# EAGLE design schema_v1_1 (EAGLE 5.12)
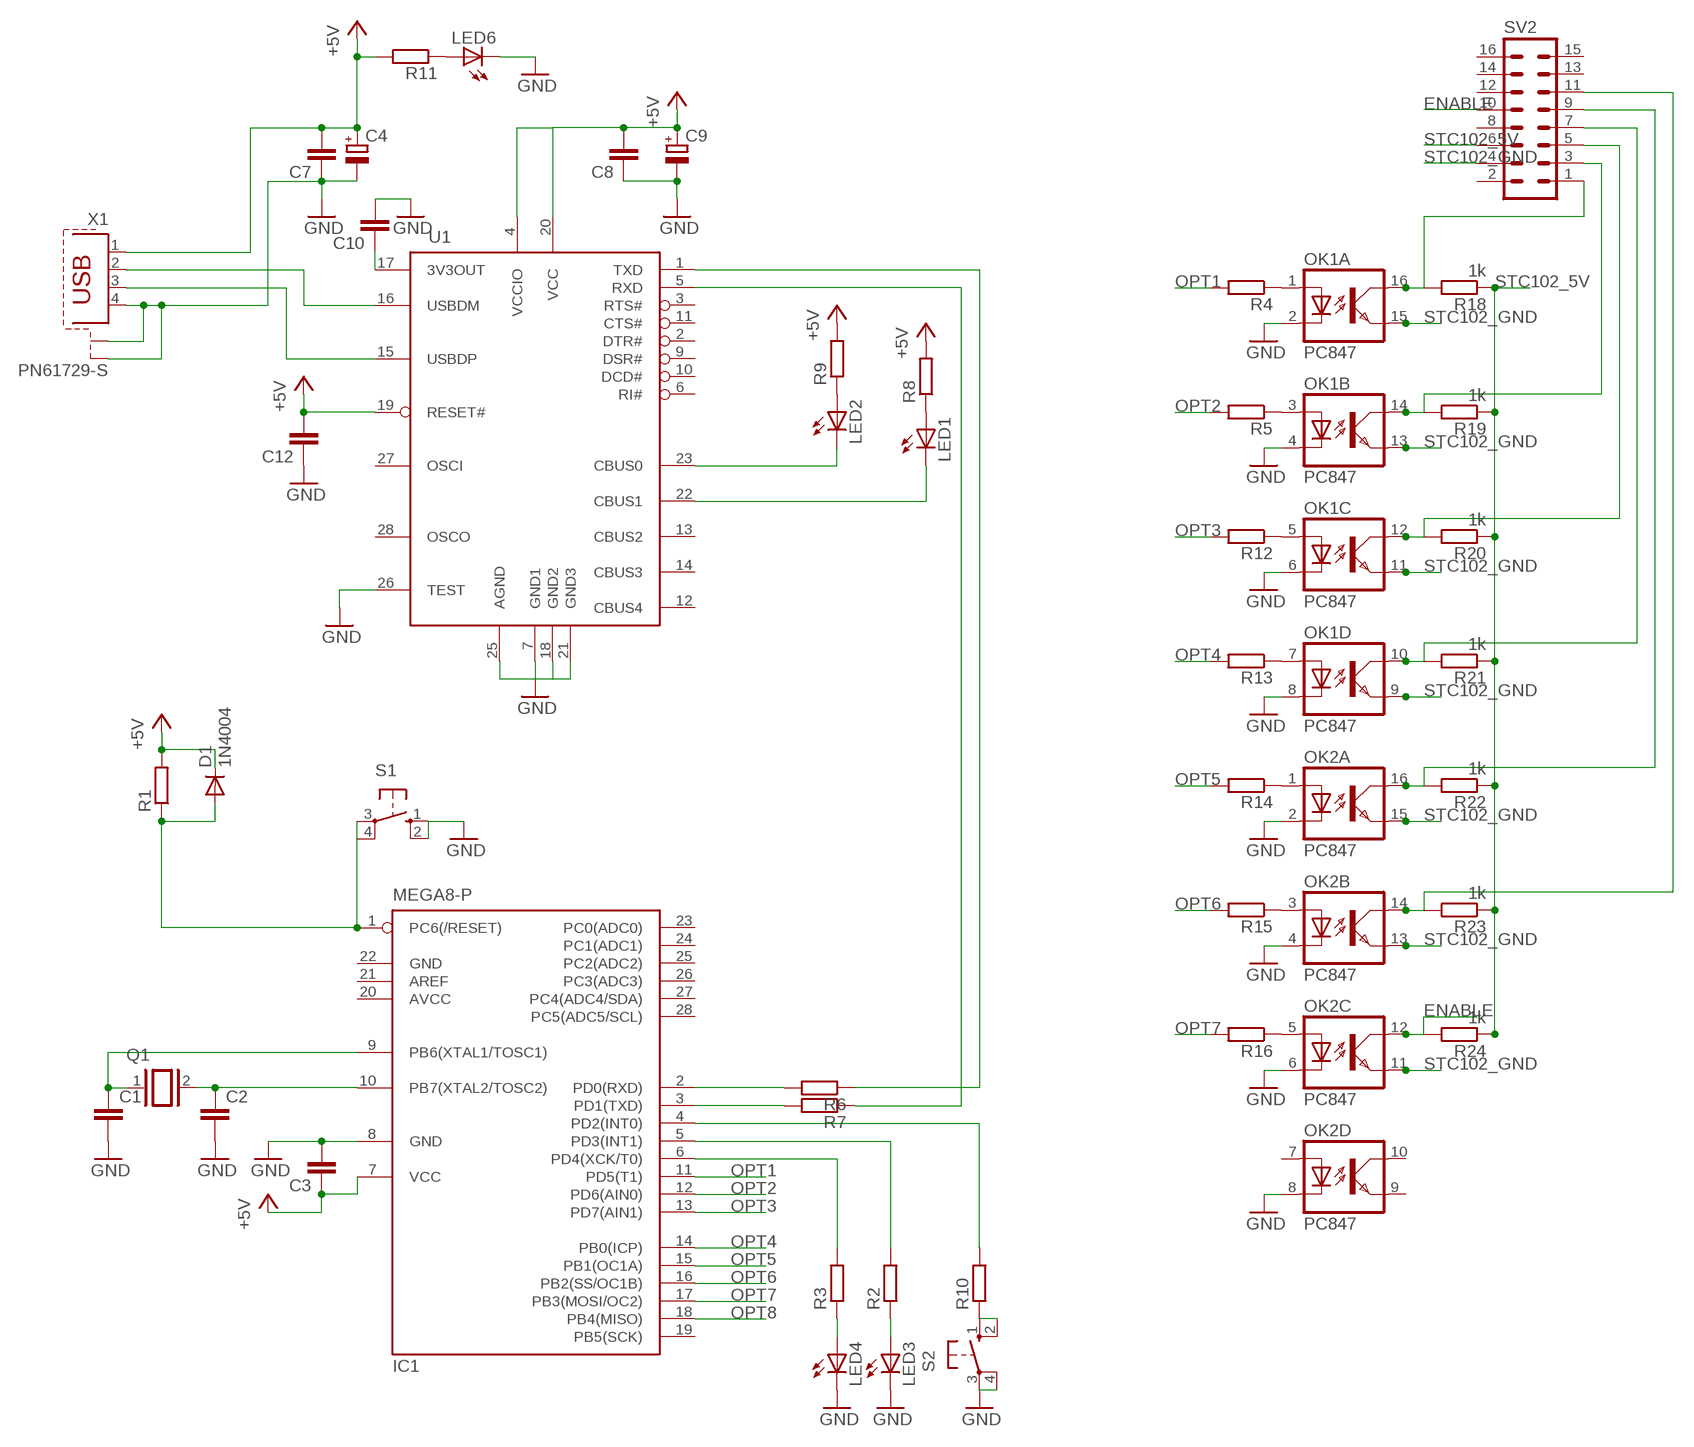
[diagram p0: schematic, sheet 1]

## Parts
C1  C-EUC0805  [C0805]
C2  C-EUC0805  [C0805]
C3  C-EUC0805  [C0805]
C4  CPOL-EUE2.5-5  [E2,5-5]
C7  C-EU025-025X050  [C025-025X050]
C8  C-EU025-025X050  [C025-025X050]
C9  CPOL-EUE2.5-5  [E2,5-5]
C10  C-EU025-025X050  [C025-025X050]
C12  C-EU025-025X050  [C025-025X050]
D1  1N4004  [DO41-10]
IC1  MEGA8-P  [DIL28-3]
LED1  LED3MM  [LED3MM]
LED2  LED3MM  [LED3MM]
LED3  LED3MM  [LED3MM]
LED4  LED3MM  [LED3MM]
LED6  LED3MM  [LED3MM]
OK1  PC847  [DIL16]
OK2  PC847  [DIL16]
Q1  XTAL  [Q]
R1  R-EU_0207/10  [0207/10]
R2  R-EU_0207/10  [0207/10]
R3  R-EU_0207/10  [0207/10]
R4  R-EU_0207/10  [0207/10]
R5  R-EU_0207/10  [0207/10]
R6  R-EU_M1206  [M1206]
R7  R-EU_M1206  [M1206]
R8  R-EU_M1206  [M1206]
R9  R-EU_M1206  [M1206]
R10  R-EU_0207/10  [0207/10]
R11  R-EU_M1206  [M1206]
R12  R-EU_0207/10  [0207/10]
R13  R-EU_0207/10  [0207/10]
R14  R-EU_0207/10  [0207/10]
R15  R-EU_0207/10  [0207/10]
R16  R-EU_0207/10  [0207/10]
R18  1k  R-EU_0207/10  [0207/10]
R19  1k  R-EU_0207/10  [0207/10]
R20  1k  R-EU_0207/10  [0207/10]
R21  1k  R-EU_0207/10  [0207/10]
R22  1k  R-EU_0207/10  [0207/10]
R23  1k  R-EU_0207/10  [0207/10]
R24  1k  R-EU_0207/10  [0207/10]
S1  10-XX  [B3F-10XX]
S2  10-XX  [B3F-10XX]
SV2  MA08-2  [MA08-2]
U1  FT232RL  [SSOP28DB]
X1  PN61729-S  [PN61729-S]

## Nets
+5V: C3.1 C4.+ C7.2 C8.2 C9.+ C12.2 D1.C IC1.7(VCC) R1.2 R8.2 R9.2 R11.2 U1.4(VCCIO) U1.19(RESET#) U1.20(VCC) X1.1
ENABLE: OK2.12(C:COL) R24.2 SV2.10
GND: C1.2 C2.2 C3.2 C4.- C7.1 C8.1 C9.- C10.2 C12.1 IC1.8(GND) LED3.K(C) LED4.K(C) LED6.K(C) OK1.2(A:C) OK1.4(B:C) OK1.6(C:C) OK1.8(D:C) OK2.2(A:C) OK2.4(B:C) OK2.6(C:C) OK2.8(D:C) S1.1(S) S1.2(S1) S2.3(P) S2.4(P1) U1.7(GND1) U1.18(GND2) U1.21(GND3) U1.25(AGND) U1.26(TEST) X1.4 X1.S1 X1.S2
N$1: C2.1 IC1.10(PB7(XTAL2/TOSC2)) Q1.2
N$2: C1.1 IC1.9(PB6(XTAL1/TOSC1)) Q1.1
N$3: D1.A IC1.1(PC6(/RESET)) R1.1 S1.3(P) S1.4(P1)
N$4: IC1.6(PD4(XCK/T0)) R3.2
N$5: IC1.4(PD2(INT0)) R10.2
N$6: LED3.A R2.1
N$7: LED4.A R3.1
N$8: R10.1 S2.1(S) S2.2(S1)
N$9: OK1.16(A:COL) R18.2 SV2.1
N$10: IC1.5(PD3(INT1)) R2.2
N$11: OK1.14(B:COL) R19.2 SV2.3
N$12: OK1.12(C:COL) R20.2 SV2.5
N$13: OK1.10(D:COL) R21.2 SV2.7
N$14: OK2.16(A:COL) R22.2 SV2.9
N$15: OK2.14(B:COL) R23.2 SV2.11
N$16: LED2.K(C) U1.23(CBUS0)
N$17: LED6.A R11.1
N$18: U1.16(USBDM) X1.2
N$19: U1.15(USBDP) X1.3
N$20: C10.1 U1.17(3V3OUT)
N$21: LED1.A R8.1
N$22: LED2.A R9.1
N$24: LED1.K(C) U1.22(CBUS1)
N$25: R6.1 U1.1(TXD)
N$26: IC1.2(PD0(RXD)) R6.2
N$27: IC1.3(PD1(TXD)) R7.2
N$28: R7.1 U1.5(RXD)
N$29: OK1.1(A:A) R4.1
N$30: OK1.3(B:A) R5.1
N$31: OK1.5(C:A) R12.1
N$32: OK1.7(D:A) R13.1
N$33: OK2.1(A:A) R14.1
N$34: OK2.3(B:A) R15.1
N$35: OK2.5(C:A) R16.1
OPT1: IC1.11(PD5(T1)) R4.2
OPT2: IC1.12(PD6(AIN0)) R5.2
OPT3: IC1.13(PD7(AIN1)) R12.2
OPT4: IC1.14(PB0(ICP)) R13.2
OPT5: IC1.15(PB1(OC1A)) R14.2
OPT6: IC1.16(PB2(SS/OC1B)) R15.2
OPT7: IC1.17(PB3(MOSI/OC2)) R16.2
OPT8: IC1.18(PB4(MISO))
STC102_5V: R18.1 R19.1 R20.1 R21.1 R22.1 R23.1 R24.1 SV2.6
STC102_GND: OK1.9(D:EMIT) OK1.11(C:EMIT) OK1.13(B:EMIT) OK1.15(A:EMIT) OK2.11(C:EMIT) OK2.13(B:EMIT) OK2.15(A:EMIT) SV2.4
Unconnected: IC1.19(PB5(SCK)) IC1.21(AREF) IC1.23(PC0(ADC0)) IC1.24(PC1(ADC1)) IC1.25(PC2(ADC2)) IC1.26(PC3(ADC3)) IC1.27(PC4(ADC4/SDA)) IC1.28(PC5(ADC5/SCL)) OK2.7(D:A) OK2.9(D:EMIT) OK2.10(D:COL) SV2.2 SV2.8 SV2.12 SV2.13 SV2.14 SV2.15 SV2.16 U1.2(DTR#) U1.3(RTS#) U1.6(RI#) U1.9(DSR#) U1.10(DCD#) U1.11(CTS#) U1.12(CBUS4) U1.13(CBUS2) U1.14(CBUS3) U1.27(OSCI) U1.28(OSCO)

## Power pins joined to a net without a drawn wire
AVCC: IC1.20(AVCC)
GND: IC1.22(GND)

## Library data of the parts
C1-C3 C7 C8 C10 C12 = rcl:C-EU: CAPACITOR, European symbol
C4 C9 = rcl:CPOL-EU: POLARIZED CAPACITOR, European symbol
D1 = diode:1N4004: DIODE general purpose rectifier, 1 A
IC1 = atmel:MEGA8-P: MICROCONTROLLER 8 Kbytes FLASH, 1 kbytes SRAM, 512 bytes EEPROM, USART, 4-channel 10 bit ADC, 2-channel 8 bit ADC Pin compatible with Atmega48, ATMega88, ATMega168 Source: avr.lbr; OC_FARNELL: unknown; OC_NEWARK: unknown
LED1-LED4 LED6 = led:LED: LED OSRAM: - CHIPLED LG R971, LG N971, LY N971, LG Q971, LY Q971, LO R971, LY R971 LH N974, LH R974 LS Q976, LO Q976, LY Q976 LO Q996 - Hyper CHIPLED LW Q18S LB Q993, LB Q99A, LB R99A - SideLED LS A670, LO A670, LY A670, LG A670, LP A670 LB A673, LV A673, LT A673, LW A673 LH A674 LY A675 LS A676, LA A676, LO A676, LY A676, LW A676 LS A679, LY A679, LG A679 - Hyper Micro SIDELED® LS Y876, LA Y876, LO Y876, LY Y876 LT Y87S - SmartLED LW L88C, LW L88S LB L89C, LB L89S, LG L890 LS L89K, LO L89K, LY L89K LS L896, LA L896, LO L896, LY L896 - TOPLED LS T670, LO T670, LY T670, LG T670, LP T670 LSG T670, LSP T670, LSY T670, LOP T670, LYG T670 LG T671, LOG T671, LSG T671 LB T673, LV T673, LT T673, LW T673 LH T674 LS T676, LA T676, LO T676, LY T676, LB T676, LH T676, LSB T676, LW T676 LB T67C, LV T67C, LT T67C, LS T67K, LO T67K, LY T67K, LW E67C LS E67B, LA E67B, LO E67B, LY E67B, LB E67C, LV E67C, LT E67C LW T67C LS T679, LY T679, LG T679 LS T770, LO T770, LY T770, LG T770, LP T770 LB T773, LV T773, LT T773, LW T773 LH T774 LS E675, LA E675, LY E675, LS T675 LS T776, LA T776, LO T776, LY T776, LB T776 LHGB T686 LT T68C, LB T68C - Hyper Mini TOPLED® LB M676 - Mini TOPLED Santana® LG M470 LS M47K, LO M47K, LY M47K Source: http://www.osram.convergy.de LUXEON: - LUMILED® LXK2-PW12-R00, LXK2-PW12-S00, LXK2-PW14-U00, LXK2-PW14-V00 LXK2-PM12-R00, LXK2-PM12-S00, LXK2-PM14-U00 LXK2-PE12-Q00, LXK2-PE12-R00, LXK2-PE12-S00, LXK2-PE14-T00, LXK2-PE14-U00 LXK2-PB12-K00, LXK2-PB12-L00, LXK2-PB12-M00, LXK2-PB14-N00, LXK2-PB14-P00, LXK2-PB14-Q00 LXK2-PR12-L00, LXK2-PR12-M00, LXK2-PR14-Q00, LXK2-PR14-R00 LXK2-PD12-Q00, LXK2-PD12-R00, LXK2-PD12-S00 LXK2-PH12-R00, LXK2-PH12-S00 LXK2-PL12-P00, LXK2-PL12-Q00, LXK2-PL12-R00 Source: www.luxeon.com KINGBRIGHT: KA-3528ASYC Source: www.kingbright.com
OK1 OK2 = optocoupler:PC847: SHARP OPTO COUPLER; OC_FARNELL: 9707735; OC_NEWARK: unknown
Q1 = special:XTAL: CRYSTAL
R1-R16 R18-R24 = rcl:R-EU_: RESISTOR, European symbol
S1 S2 = switch-omron:10-XX: OMRON SWITCH; MPN: B3F-1000; OC_FARNELL: 176432; OC_NEWARK: 36M3542
SV2 = con-lstb:MA08-2: PIN HEADER; OC_FARNELL: unknown; OC_NEWARK: unknown
U1 = ftdichip-5:FT232RL: USB UART 4th Generation USB UART (USB <-> Serial) Controller
X1 = con-berg:PN61729-S: BERG USB connector; OC_FARNELL: unknown; OC_NEWARK: unknown

## Board
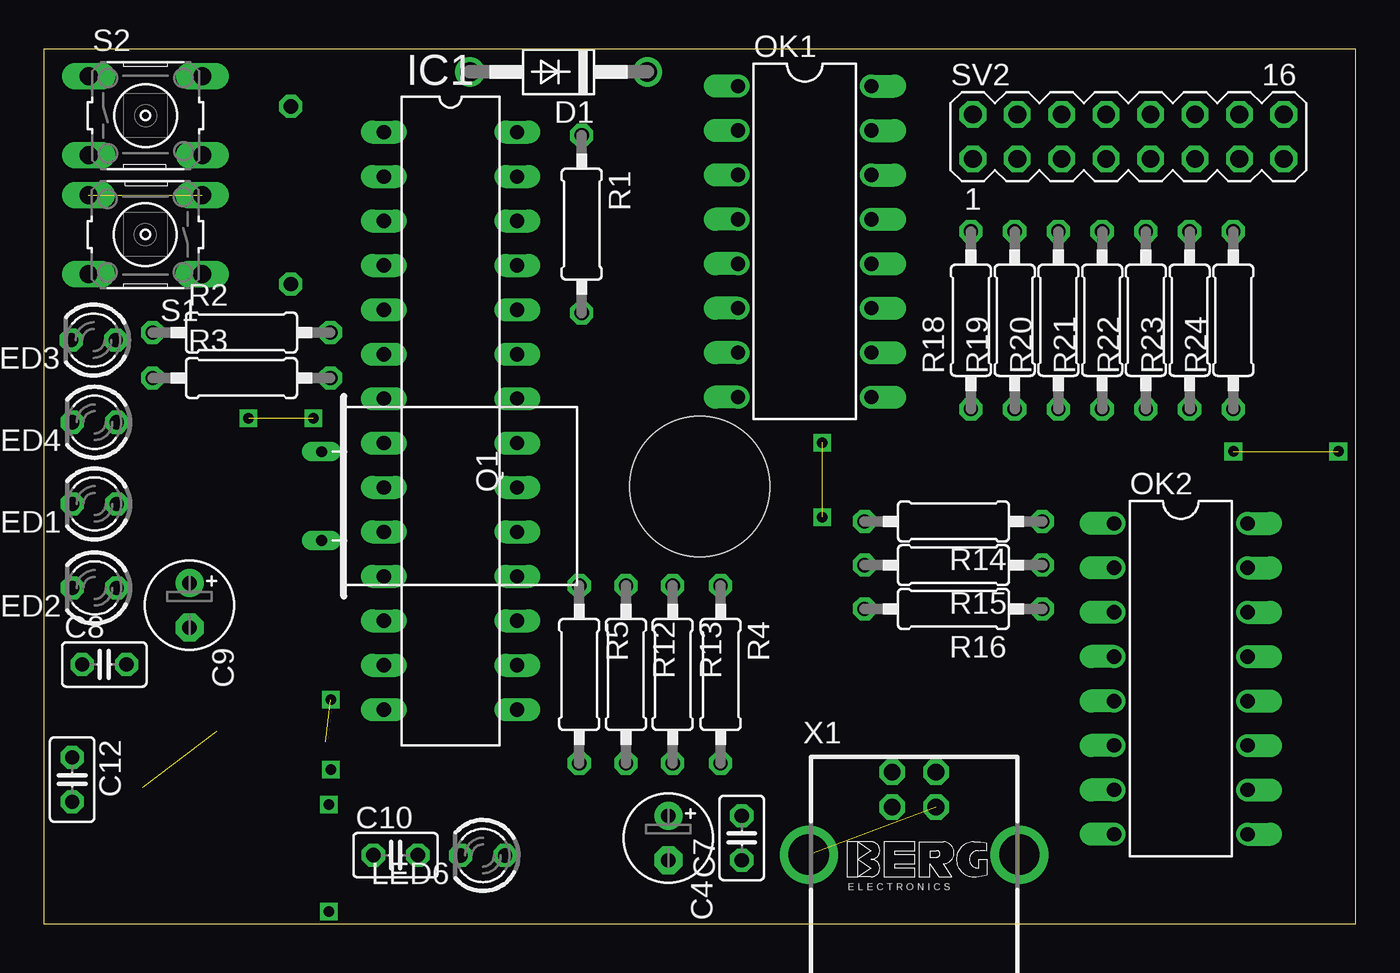
[diagram p1: board, top side]
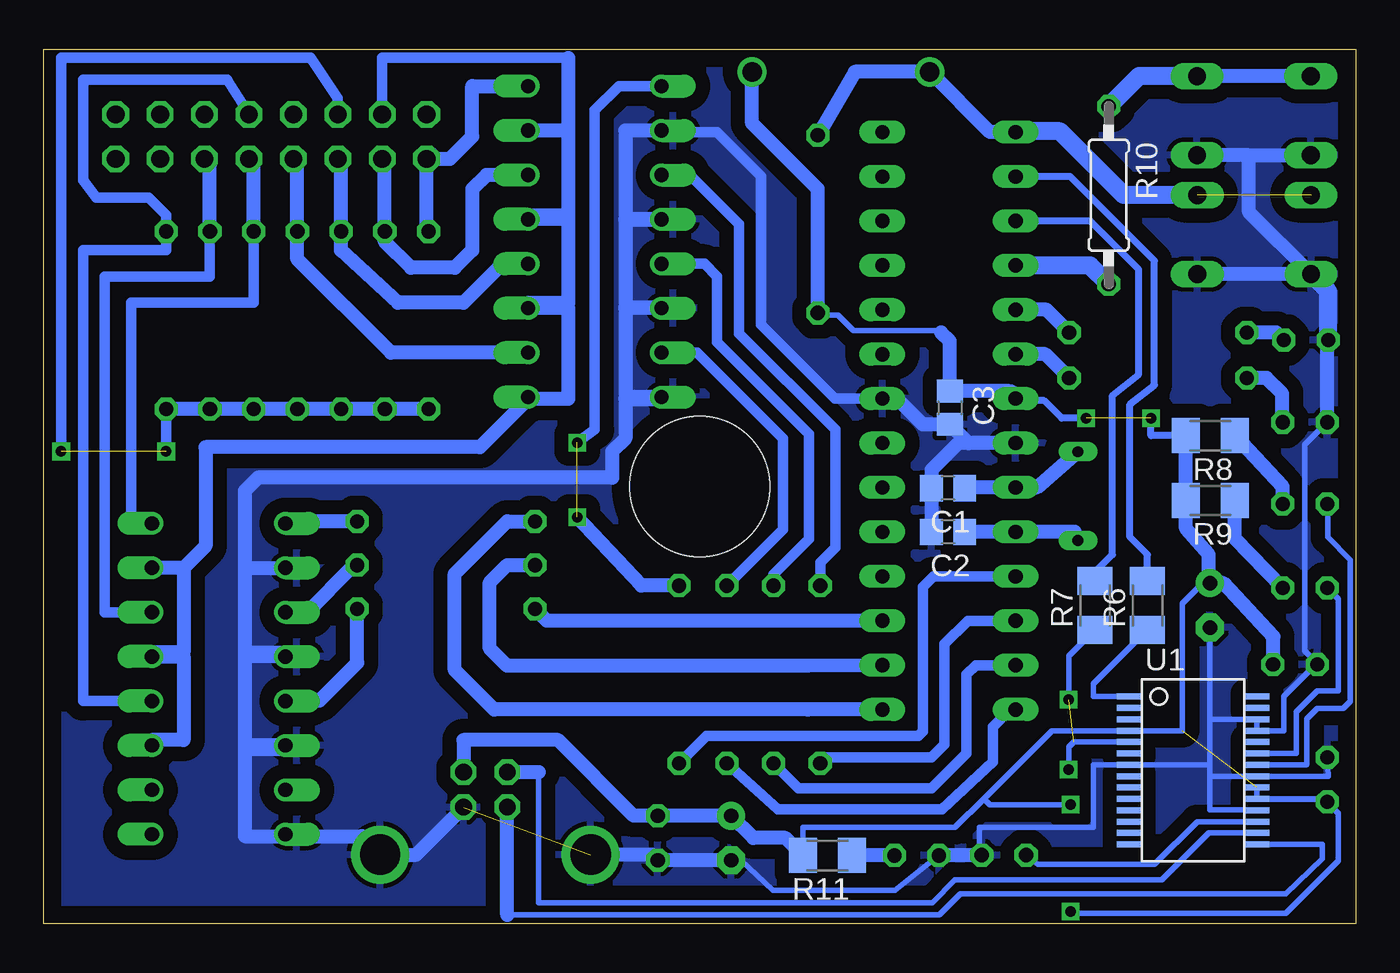
[diagram p2: board, bottom side, seen from below]

Size 75 x 50 mm. Coordinates in mm from the lower left corner, seen from the top.
Outline: 0,0 75,0 75,50 0,50 0,0
Copper layers (1*16): Top 0.035mm / dielectric 1.5mm / Bottom 0.035mm
Design rules "default": minimum track width 10mil, minimum drill 24mil, track to track 8mil, track to pad 8mil, pad to pad 8mil, via to via 8mil, smd to smd 8mil, copper to edge 40mil, drill to drill 8mil, minimum pad ring 10mil, minimum via ring 8mil, stop-mask expansion 4mil, vias tented up to drill 0mil, thermal gap 10mil
Holes 8 mm at 37.5,25

### Footprints (pad centres in the part's own frame; a part is rotated, then mirrored left to right if it is on the bottom)
C0805 = smd 1.3 x 1.5: 1 -0.95,0; 2 0.95,0
E2,5-5 = drill 0.813 pad 1.6 round: + -1.27,0 | drill 0.813 pad 1.6 octagon: - 1.27,0
C025-025X050 = drill 0.813 octagon: 1 -1.27,0; 2 1.27,0
DO41-10 = drill 1.118 round: A 5.08,0; C -5.08,0
DIL28-3 = drill 0.813 long: 1 -16.51,-3.81; 2 -13.97,-3.81; 3 -11.43,-3.81; 4 -8.89,-3.81; 5 -6.35,-3.81; 6 -3.81,-3.81; 7 -1.27,-3.81; 8 1.27,-3.81; 9 3.81,-3.81; 10 6.35,-3.81; 11 8.89,-3.81; 12 11.43,-3.81; 13 13.97,-3.81; 14 16.51,-3.81; 15 16.51,3.81; 16 13.97,3.81; 17 11.43,3.81; 18 8.89,3.81; 19 6.35,3.81; 20 3.81,3.81; 21 1.27,3.81; 22 -1.27,3.81; 23 -3.81,3.81; 24 -6.35,3.81; 25 -8.89,3.81; 26 -11.43,3.81; 27 -13.97,3.81; 28 -16.51,3.81
LED3MM = drill 0.813 octagon: A -1.27,0; K 1.27,0
DIL16 = drill 0.813 offset: 1 -8.89,-3.81; 2 -6.35,-3.81; 3 -3.81,-3.81; 4 -1.27,-3.81; 5 1.27,-3.81; 6 3.81,-3.81; 7 6.35,-3.81; 8 8.89,-3.81; 9 8.89,3.81; 10 6.35,3.81; 11 3.81,3.81; 12 1.27,3.81; 13 -1.27,3.81; 14 -3.81,3.81; 15 -6.35,3.81; 16 -8.89,3.81
Q = drill 0.61 long: 1 -2.54,-7.62; 2 2.54,-7.62
0207/10 = drill 0.813 octagon: 1 -5.08,0; 2 5.08,0
M1206 = smd 1.6 x 2: 1 -1.4,0; 2 1.4,0
B3F-10XX = drill 1.016 long: 1 -3.251,2.261; 2 3.251,2.261; 3 -3.251,-2.261; 4 3.251,-2.261
MA08-2 = drill 1.016 octagon: 1 -8.89,-1.27; 2 -8.89,1.27; 3 -6.35,-1.27; 4 -6.35,1.27; 5 -3.81,-1.27; 6 -3.81,1.27; 7 -1.27,-1.27; 8 -1.27,1.27; 9 1.27,-1.27; 10 1.27,1.27; 11 3.81,-1.27; 12 3.81,1.27; 13 6.35,-1.27; 14 6.35,1.27; 15 8.89,-1.27; 16 8.89,1.27
SSOP28DB = smd 0.348 x 1.397: 1 -4.225,-3.656; 2 -3.575,-3.656; 3 -2.925,-3.656; 4 -2.275,-3.656; 5 -1.625,-3.656; 6 -0.975,-3.656; 7 -0.325,-3.656; 8 0.325,-3.656; 9 0.975,-3.656; 10 1.625,-3.656; 11 2.275,-3.656; 12 2.925,-3.656; 13 3.575,-3.656; 14 4.225,-3.656; 15 4.225,3.656; 16 3.575,3.656; 17 2.925,3.656; 18 2.275,3.656; 19 1.625,3.656; 20 0.975,3.656; 21 0.325,3.656; 22 -0.325,3.656; 23 -0.975,3.656; 24 -1.625,3.656; 25 -2.275,3.656; 26 -2.925,3.656; 27 -3.575,3.656; 28 -4.225,3.656
PN61729-S = drill 0.95 octagon: 1 1.25,4.71; 2 -1.25,4.71; 3 -1.25,2.71; 4 1.25,2.71 | drill 2.3 pad 2.9 round: S1 -6.02,0; S2 6.02,0

### Placement (x,y rotation side)
C1  23.3,24.9 180 bottom
C2  23.3,22.4 180 bottom
C3  23.2,29.5 270 bottom
C4  35.7,4.9 270 top
C7  39.9,4.9 90 top
C8  3.46,14.82 0 top
C9  8.33,18.2 270 top
C10  20.11,3.92 0 top
C12  1.62,8.24 270 top
D1  29.43,48.7 180 top
IC1  23.25,28.75 270 top
LED1  2.9,24 180 top
LED2  2.9,19.2 180 top
LED3  2.84,33.37 180 top
LED4  2.9,28.67 180 top
LED6  25.1,3.9 180 top
OK1  43.5,39 270 top
OK2  65,14 270 top
Q1  23.5,24.45 270 top
R1  30.75,40 270 top
R2  11.3,33.8 0 top
R3  11.3,31.2 0 top
R4  38.69,14.25 270 top
R5  30.61,14.25 270 top
R6  11.9,18.2 90 bottom
R7  14.9,18.2 90 bottom
R8  8.3,27.9 180 bottom
R9  8.3,24.2 180 bottom
R10  14.12,41.65 270 bottom
R11  30.2,3.9 180 bottom
R12  33.28,14.25 270 top
R13  35.95,14.25 270 top
R14  52,23 180 top
R15  52,20.5 180 top
R16  52,18 180 top
R18  53,34.5 90 top
R19  55.5,34.5 90 top
R20  58,34.5 90 top
R21  60.5,34.5 90 top
R22  63,34.5 90 top
R23  65.5,34.5 90 top
R24  68,34.5 90 top
S1  5.8,39.4 180 top
S2  5.82,46.2 0 top
SV2  62,45 0 top
U1  9.3,8.76 270 bottom
X1  49.75,3.95 0 top

### Tracks (layer width: path | path; a pad name or v marks a point on that pad's centre or on a via)
+5V  (via drill 0.6)  (2 unrouted)
  Bottom 0.305: R1.2 30.75,34.75 30.85,34.75 30.9,34.8 29.6,34.8 28.7,33.9 23.8,33.9 | R11.2 31.6,5.5 22.9,5.5 21.25,7.15 | 21.25,7.15 17.36,11.04 U1.4 9.9,11.04 9.9,18.3 8.73,19.47 C9.+ | C12.2 1.78,7.13 U1.19 U1.20 5.64,7.16 5.7,7.1 1.8,7.1 1,6.3 1,3.6 4,0.6 16.2,0.6 16.3,0.7 | 16.3,6.8 20.9,6.8 21.25,7.15
  Bottom 0.406: 23.7,33.8 arc-90 23.8,33.9 | R8.2 11.7,27.9 v11.7,28.9 | v15.4,28.9 16.8,28.9 17.8,29.9 19.32,29.9 IC1.7
  Bottom 0.813: D1.C 34.51,45.76 30.75,42 R1.2 | R11.2 32.6,4.9 34.43,4.9 C4.+ C7.2 41.27,6.17 45.6,10.5 51,10.5 X1.1 | R8.2 R9.2 9.7,22.6 8.4,21.1 8.4,19.54 C9.+ 7.57,19.47 4.7,16.4 4.7,14.85 C8.2 | 23.7,33.8 23.2,33.3 C3.1 19.87,30.45 arc90 IC1.7
ENABLE
  Bottom 0.61: SV2.10 64.5,48.25 72.75,48.25 72.75,42.5 72,41.5 69,41.5 68,40.5 R24.2 68,38.5 72.75,38.5 72.75,12.73 OK2.12
GND  (1 unrouted)
  Bottom 0.305: C4.- 35.13,3.63 33.3,1.9 26.33,1.9 LED6.K | C12.1 1.58,8.44 U1.21 8.33,8.44 | U1.18 5.64,6.5 8.33,6.5 8.33,8.44 | 8.33,11.69 U1.26 U1.25 4.1,11.04 4.1,13 2.28,14.82 C8.1 2.19,14.89 2.9,15.6 2.9,27.4 LED4.K | 8.33,11.69 C9.- | 8.33,8.44 8.33,9 | 8.33,9 8.33,11.69 | 8.33,9 8.41,9.09 U1.7 15,9.09 15,5.5 21.5,5.5 21.5,4.04 C10.2
  Bottom 0.61: IC1.22 29.77,30.02 34,34.25 34,42.75 36.5,45.25 39.59,45.25 OK1.2
  Bottom 0.813: 63.5,20.35 OK2.2 | 63.5,20.35 63.5,15.5 61.19,15.5 OK2.4 63.5,15.27 63.5,10 61.19,10 OK2.6 63.5,10.19 63.5,5 61.19,5 | 61.19,5 OK2.8 | OK1.2 41.75,45.35 41.75,40.25 39.69,40.25 OK1.4 41.75,40.27 41.75,35.25 39.69,35.25 OK1.6 41.75,35.19 41.75,30 | 41.75,30 39.69,30 | 39.69,30 OK1.8 41.64,30.11 | 63.5,20.35 63.5,24.75 62.75,25.5 42.5,25.5 42.5,27 41.75,27.75 41.75,30 | 39.69,30 39.67,30.02 | S1.1 S1.2 6.1,40.69 6.1,43.94 | 6.1,43.94 S2.3 | LED3.K 1.63,33.31 LED4.K | 61.19,5 56.82,5 X1.S2 53.71,3.95 X1.4 | X1.S1 40.22,3.95 C7.1 C4.- | IC1.8 22.13,27.48 | 22.13,27.48 C3.2 24.75,28.55 26.2,30 27.04,30 IC1.22 | C2.2 C1.2 24.25,25.95 22.72,27.48 22.13,27.48 | 6.1,43.94 S2.4 | 21.5,4.04 21.64,3.9 LED6.K
  Bottom 1.016: LED3.K 1.57,36.16 S1.2
  pour Bottom (isolate 0.813): 0,50 75,50 75,0 0,0
N$1
  Bottom 0.813: Q1.2 16.07,22.4 IC1.10 C2.1
N$2
  Bottom 0.813: Q1.1 18.23,24.94 IC1.9 22.31,24.94 arc-90 C1.1
N$3  (1 unrouted)
  Bottom 0.813: IC1.1 20.91,45.26 D1.A 28.63,48.7 R1.1
  Bottom 1.016: S1.3 13.26,41.66 16.9,45.3 19.4,45.3 IC1.1
N$4
  Bottom 0.813: IC1.6 17.74,32.56 R3.2
N$5
  Bottom 1.016: R10.2 15.19,37.64 IC1.4
N$6
  Bottom 0.813: R2.1 4.54,33.8 LED3.A
N$7
  Bottom 0.813: R3.1 5.1,31.2 4.2,30.3 4.2,28.7 LED4.A
N$8
  Bottom 0.813: S2.1 S2.2
  Bottom 1.016: S2.2 12.39,48.46 R10.1
N$9
  Bottom 0.813: R18.2 53.11,39.58 SV2.1 | SV2.1 52.84,44 | OK1.16 50.5,47.89 50.5,45 51.77,43.73 SV2.1
N$10
  Bottom 0.813: IC1.5 17.68,35.1 R2.2
N$11
  Bottom 0.813: SV2.3 55.5,43.58 R19.2 55.5,39 54,37.5 51.5,37.5 50.5,38.5 50.5,42 49.69,42.81 OK1.14
N$12
  Bottom 0.813: SV2.5 58,43.54 R20.2 58,38.5 54.75,35.5 51,35.5 48.77,37.73 OK1.12
N$13
  Bottom 0.813: SV2.7 60.5,43.5 R21.2 60.5,38 55.15,32.65 OK1.10
N$14
  Bottom 0.61: R22.2 63,35.5 70,35.5 70,22.89
  Bottom 0.813: R22.2 63,43.46 SV2.9 | OK2.16 70,22.89
N$15
  Bottom 0.61: R23.2 65.5,37 71.5,37 71.5,17.81 OK2.14
  Bottom 0.813: R23.2 65.5,43.42 SV2.11
N$16
  Bottom 0.305: U1.23 3.4,9.73 3.4,12.1 2.2,13.3 1,13.3 1,18.57 LED2.K
N$17
  Bottom 0.813: LED6.A R11.1
N$18
  Bottom 0.305: 46.7,8.66 46.7,1.2 24.2,1.2 22.9,2.5 11.09,2.5 8.4,5.18 U1.16
  Bottom 0.813: 46.7,8.66 X1.2
N$19
  Bottom 0.305: 2,4.54 1.9,4.54 | 2,4.54 U1.15 | 48.5,0.5 23.8,0.5 22.6,1.7 4,1.7 1.9,3.7 1.9,4.43 2,4.54
  Bottom 0.813: 48.5,0.5 X1.3
N$20
  Bottom 0.305: C10.1 18.16,3.4 11.5,3.4 9.06,5.83 U1.17
N$21
  Bottom 0.813: R8.1 4.17,24.97 LED1.A
N$22
  Bottom 0.813: R9.1 6.9,22.03 LED2.A
N$23  (via drill 0.6)
  other vias: 16.3,0.7
N$24
  Bottom 0.305: U1.22 2.81,9.09 2.8,9.1 2.8,11.7 2.2,12.3 0.7,12.3 0.3,12.7 0.3,20.8 1.6,22.1 1.6,23.97 LED1.K
N$25
  Bottom 0.305: R6.1 15,13.7 15,12.98 U1.1
N$26
  Bottom 0.406: IC1.2 16.32,42.72 11.5,37.9 11.5,30.8 12.9,29.7 12.9,22.1 11.9,21.1 R6.2
N$27
  Bottom 0.406: IC1.3 15.18,40.18 12.4,37.4 12.4,31.4 13.9,30.2 13.9,21.1 14.9,20.1 R7.2
N$28  (via drill 0.6)  (1 unrouted)
  Bottom 0.305: R7.1 16.4,15.3 v16.4,12.8 | U1.5 16.11,10.38 16.4,10.1 v16.4,8.8
N$29  (via drill 0.6)  (1 unrouted)
  Bottom 0.61: v44.5,27.5 43.5,28.25 43.5,46.5 42.11,47.89 OK1.1
  Bottom 0.813: R4.1 40.83,19.33 v44.5,23.25
N$30
  Bottom 0.61: R5.1 30.61,20.64 29.75,21.5 29.75,28.25 35.25,33.75 35.25,40 38.06,42.81 OK1.3
N$31
  Bottom 0.61: R12.1 33.28,19.97 31.25,22 31.25,28 36.5,33.25 36.5,37 37.23,37.73 OK1.5
N$32
  Bottom 0.61: OK1.7 37.65,32.65 32.75,27.75 32.75,22.53 R13.1
N$33
  Bottom 0.813: R14.1 61.08,23 OK2.1
N$34
  Bottom 0.813: R15.1 57.25,20.5 60,17.75 61.13,17.75 OK2.3
N$35
  Bottom 0.813: R16.1 57.08,14.92 59.25,12.75 61.17,12.75 OK2.5
N$36  (via drill 0.6)
  other vias: 16.3,6.8
OPT1
  Bottom 0.61: R4.2 37.11,10.75 25,10.75 24.75,11 24.75,19.25 24.14,19.86 IC1.11
OPT2
  Bottom 0.61: R5.2 30.28,9.5 24.25,9.5 23.5,10.25 23.5,16 22.18,17.32 IC1.12
OPT3
  Bottom 0.61: R12.2 31.86,7.75 24.25,7.75 22.25,9.75 22.25,14.25 21.72,14.78 IC1.13
OPT4
  Bottom 0.61: R13.2 33.03,6.55 23.65,6.55 20.75,9.25 20.75,11.25 19.76,12.24 IC1.14
OPT5
  Bottom 0.813: R14.2 48.5,23 51.5,20 51.5,14.5 49.25,12.25 31.32,12.25 IC1.15
OPT6
  Bottom 0.813: R15.2 48.5,20.5 49.5,19.5 49.5,15.75 48.5,14.75 31.34,14.75 IC1.16
OPT7
  Bottom 0.813: R16.2 46.24,17.32 IC1.17
STC102_5V  (via drill 0.6)  (1 unrouted)
  Bottom 0.61: SV2.6 58.19,47.19 59.75,49.5 74,49.5 v74,27 | R24.1 v68,27
  Bottom 0.813: R18.1 R19.1 R20.1 R21.1 R22.1 R23.1 R24.1
STC102_GND
  Bottom 0.61: SV2.4 55.65,49.5 45,49.5
  Bottom 0.813: 67,20.35 OK2.15 | 67,20.35 67,15.5 68.81,15.5 OK2.13 67,15.27 67,10.5 68.81,10.5 OK2.11 | 45,45.35 OK1.15 | 45,45.35 45,40.5 47.31,40.5 OK1.13 45,40.27 45,35.5 47.31,35.5 OK1.11 45,35.19 45,30 47.31,30 | 47.31,30 OK1.9 | 45,45.35 45,49.5 | 47.31,30 50.06,27.25 65.75,27.25 65.75,21.6 67,20.35